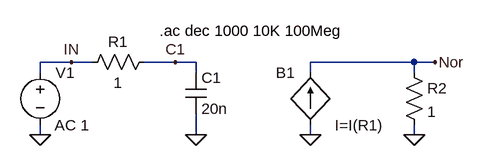
[diagram p0: schematic Fig_2-70_AC_BI-Source.asc]
Fig_2-70_AC_BI-Source.asc, the LTspice schematic file:
Version 4
SHEET 1 1612 884
WIRE 304 256 256 256
WIRE 336 256 304 256
WIRE 464 256 416 256
WIRE 496 256 464 256
WIRE 832 256 672 256
WIRE 864 256 832 256
WIRE 256 272 256 256
WIRE 496 272 496 256
WIRE 672 272 672 256
WIRE 832 272 832 256
WIRE 256 368 256 352
WIRE 496 368 496 336
WIRE 672 368 672 352
WIRE 832 368 832 352
FLAG 496 368 0
FLAG 256 368 0
FLAG 304 256 IN
FLAG 464 256 C1
FLAG 672 368 0
FLAG 864 256 Nor
FLAG 832 368 0
SYMBOL voltage 256 256 R0
WINDOW 123 22 97 Left 2
WINDOW 39 0 0 Left 0
WINDOW 3 24 44 Left 2
SYMATTR Value2 AC 1
SYMATTR Value ""
SYMATTR InstName V1
SYMBOL cap 480 272 R0
SYMATTR InstName C1
SYMATTR Value 20n
SYMBOL res 320 272 R270
WINDOW 0 32 56 VTop 2
WINDOW 3 0 56 VBottom 2
SYMATTR InstName R1
SYMATTR Value 1
SYMBOL res 816 256 R0
SYMATTR InstName R2
SYMATTR Value 1
SYMBOL bi 672 352 R180
WINDOW 0 24 80 Left 2
WINDOW 3 -113 -1 Left 2
SYMATTR InstName B1
SYMATTR Value I=I(R1)
TEXT 440 208 Left 2 !.ac dec 1000 10K 100Meg

The netlist it stands for:
* Fig_2-70_AC_BI-Source.asc
V1 IN 0 AC 1
C1 C1 0 20n
R1 IN C1 1
R2 Nor 0 1
B1 0 Nor I=I(R1)
.ac dec 1000 10K 100Meg
.backanno
.end